# EAGLE design untitled (EAGLE 9.6.2)
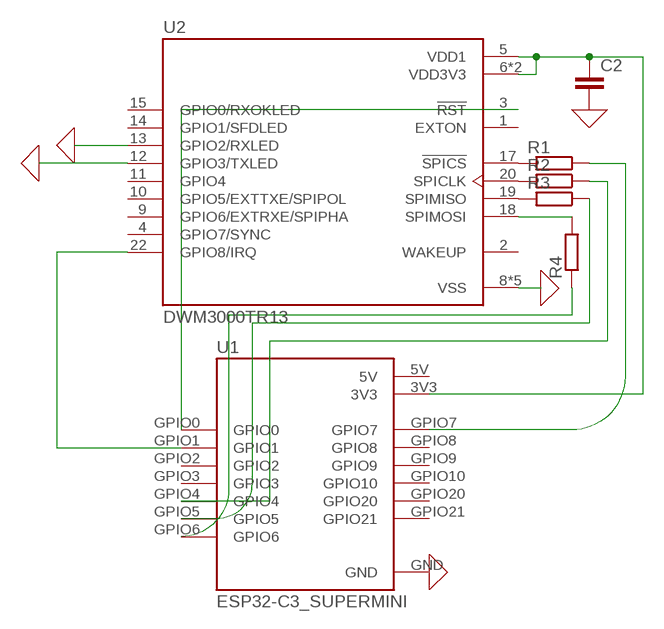
[diagram p0: schematic, sheet 1]

## Parts
C2  C-EUC0402K  [C0402K]
R1  SMK  [SMK]
R2  SMK  [SMK]
R3  SMK  [SMK]
R4  SMK  [SMK]
U1  ESP32-C3_SUPERMINI  [MODULE_ESP32-C3_SUPERMINI]
U2  DWM3000TR13  [XCVR_DWM3000TR13]

## Nets
0: C2.2 U1.GND U2.8(VSS) U2.12(GPIO3/TXLED) U2.13(GPIO2/RXLED) U2.16(VSS) U2.21(VSS) U2.23(VSS) U2.24(VSS) ; supply symbol labelled GND
N$1: U1.GPIO1 U2.22(GPIO8/IRQ)
N$2: C2.1 U1.3V3 U2.5(VDD1) U2.6(VDD3V3) U2.7(VDD3V3)
N$3: U1.GPIO0 U2.3(!RST)
N$4: R1.2 U2.17(!SPICS)
N$5: R1.1 U1.GPIO7
N$6: R2.2 U2.20(SPICLK)
N$7: R2.1 U1.GPIO4
N$8: R3.2 U2.19(SPIMISO)
N$9: R3.1 U1.GPIO5
N$10: R4.1 U2.18(SPIMOSI)
N$11: R4.2 U1.GPIO6
Unconnected: U1.GPIO2 U1.GPIO3 U1.GPIO8 U1.GPIO9 U1.GPIO10 U1.GPIO20 U1.GPIO21 U2.1(EXTON) U2.2(WAKEUP) U2.4(GPIO7/SYNC) U2.9(GPIO6/EXTRXE/SPIPHA) U2.10(GPIO5/EXTTXE/SPIPOL) U2.11(GPIO4) U2.14(GPIO1/SFDLED) U2.15(GPIO0/RXOKLED)

## Power pins joined to a net without a drawn wire
5V: U1.5V

## Library data of the parts
C2 = resistor:C-EU: CAPACITOR, European symbol
R1-R4 = resistor-shunt:SMK: SMD SHUNT RESISTOR; OC_FARNELL: unknown; OC_NEWARK: unknown
U1 = ESP32-C3_SUPERMINI:ESP32-C3_SUPERMINI: Check availability <https://pricing.snapeda.com/parts/ESP32-C3%20SuperMini/Espressif%20Systems/view-part?ref=eda>; AVAILABILITY: Not in stock; CHECK_PRICES: https://www.snapeda.com/parts/ESP32-C3%20SuperMini/Espressif+Systems/view-part/?ref=eda; DESCRIPTION: Super tiny ESP32-C3 board; MF: Espressif Systems; MP: ESP32-C3 SuperMini; PACKAGE: Package; PRICE: None; SNAPEDA_LINK: https://www.snapeda.com/parts/ESP32-C3%20SuperMini/Espressif+Systems/view-part/?ref=snap
U2 = DWM3000TR13:DWM3000TR13: Check availability <https://pricing.snapeda.com/parts/DWM3000TR13/Qorvo/view-part?ref=eda>; AVAILABILITY: In Stock; CHECK_PRICES: https://www.snapeda.com/parts/DWM3000TR13/Qorvo/view-part/?ref=eda; DESCRIPTION: RF Modules DW1000 based module; MF: Qorvo; MP: DWM3000TR13; PACKAGE: None; PRICE: None; SNAPEDA_LINK: https://www.snapeda.com/parts/DWM3000TR13/Qorvo/view-part/?ref=snap

## Board
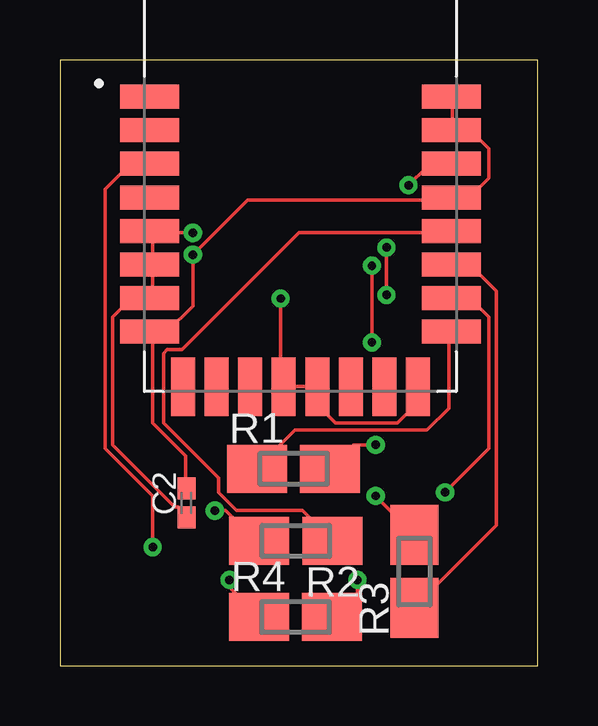
[diagram p1: board, top side]
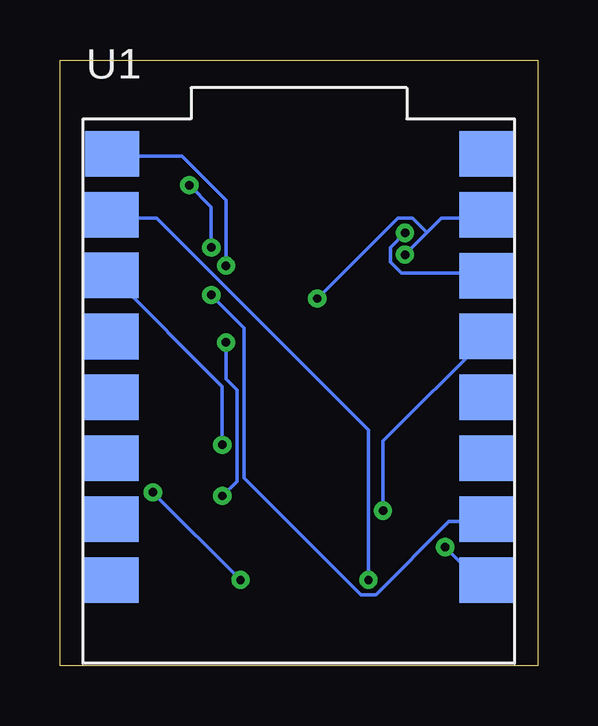
[diagram p2: board, bottom side, seen from below]

Size 19.93 x 25.26 mm. Coordinates in mm from the lower left corner, seen from the top.
Outline: 0,0 19.93,0 19.93,25.26 0,25.26 0,0
Copper layers (1*16): Top 0.035mm / dielectric 1.5mm / Bottom 0.035mm
Design rules "default": minimum track width 6mil, minimum drill 0.35mm, track to track 6mil, track to pad 6mil, pad to pad 6mil, via to via 6mil, smd to smd 6mil, copper to edge 40mil, drill to drill 6mil, minimum pad ring 10mil, minimum via ring 8mil, stop-mask expansion 4mil, vias tented up to drill 0mil, thermal gap 10mil

### Footprints (pad centres in the part's own frame; a part is rotated, then mirrored left to right if it is on the bottom)
C0402K = smd 0.925 x 0.74: 1 -0.6,0; 2 0.6,0
SMK = smd 2.5 x 2: 1 1.524,0; 2 -1.524,0
MODULE_ESP32-C3_SUPERMINI = smd 2.25 x 1.9: 3V3 7.803,4.818; 5V 7.805,9.897; GND 7.803,7.36; GPIO0 7.803,-7.883; GPIO1 7.803,-5.335; GPIO2 7.803,-2.793; GPIO3 7.803,-0.258; GPIO4 7.803,2.283; GPIO5 -7.793,9.901; GPIO6 -7.804,7.356; GPIO7 -7.804,4.823; GPIO8 -7.804,2.278; GPIO9 -7.804,-0.256; GPIO10 -7.804,-2.801; GPIO20 -7.804,-5.334; GPIO21 -7.804,-7.879
XCVR_DWM3000TR13 = smd 2.45 x 1: 1 -6.295,0.95; 2 -6.295,-0.45; 3 -6.295,-1.85; 4 -6.295,-3.25; 5 -6.295,-4.65; 6 -6.295,-6.05; 7 -6.295,-7.45; 8 -6.295,-8.85; 17 6.295,-8.85; 18 6.295,-7.45; 19 6.295,-6.05; 20 6.295,-4.65; 21 6.295,-3.25; 22 6.295,-1.85; 23 6.295,-0.45; 24 6.295,0.95 | smd 1 x 2.45: 9 -4.9,-11.145; 10 -3.5,-11.145; 11 -2.1,-11.145; 12 -0.7,-11.145; 13 0.7,-11.145; 14 2.1,-11.145; 15 3.5,-11.145; 16 4.9,-11.145

### Placement (x,y rotation side)
C2  5.28,6.79 90 top
R1  9.74,8.22 0 top
R2  9.83,5.21 180 top
R3  14.78,3.93 90 top
R4  9.82,2.04 0 top
U1  9.96,11.45 0 bottom
U2  10.03,22.78 0 top

### Tracks (layer width: path | path; a pad name or v marks a point on that pad's centre or on a via)
0  (via drill 0.35)
  Top 0.152: U2.16 14.84,11.5 14.84,10.89 14.08,10.13 11.49,10.13 10.88,10.74 10.88,11.5 U2.13 10.73,11.65 9.35,11.65 U2.12 9.2,11.65 v9.2,15.31 | U2.24 16.36,23.69 16.36,22.47 U2.23 16.36,22.32 17.13,22.32 17.89,21.56 17.89,20.34 17.13,19.58 16.36,19.58 U2.21 16.21,19.43 7.83,19.43 v5.54,17.14 5.54,15.01 4.48,13.94 3.87,13.94 U2.8 3.87,13.79 3.87,10.13 5.24,8.76 5.24,7.54 C2.2
  Bottom 0.152: v5.54,17.14 4.63,18.05 | 4.63,18.05 4.02,18.66 2.19,18.66 U1.GND | v9.2,15.31 5.85,18.66 5.24,18.66 4.63,18.05
N$1  (via drill 0.35)
  Top 0.152: v13.62,17.44 v13.62,15.46 | v14.54,20.03 15.3,20.8 16.21,20.8 U2.22
  Bottom 0.152: v13.62,15.46 12.25,14.09 12.25,7.84 7.37,2.97 6.76,2.97 3.72,6.01 2.19,6.01 U1.GPIO1 | v13.62,17.44 13.62,19.12 v14.54,20.03
N$2  (via drill 0.35)
  Top 0.152: 3.87,18.05 v5.54,18.05 | 3.87,18.05 3.87,16.84 U2.6 3.87,16.68 3.87,15.46 U2.7 3.72,15.31 2.95,15.31 2.19,14.55 2.19,9.22 4.78,6.62 4.93,6.62 5.24,6.32 C2.1 | 3.87,18.05 U2.5
  Bottom 0.152: v5.54,18.05 6.15,17.44 6.15,16.84 5.7,16.38 2.19,16.38 U1.3V3
N$3  (via drill 0.35)
  Top 0.152: v3.87,4.95 3.87,7.08 1.89,9.06 1.89,19.88 2.8,20.8 3.72,20.8 U2.3
  Bottom 0.152: v3.87,4.95 2.5,3.58 2.19,3.58 U1.GPIO0
N$4
  Top 0.152: U2.17 16.21,13.79 16.21,10.74 15.3,9.82 9.81,9.82 8.29,8.3 R1.2
N$5  (via drill 0.35)
  Top 0.152: v13.16,9.22 12.25,9.22 11.34,8.3 R1.1
  Bottom 0.152: v13.16,9.22 13.16,11.65 17.74,16.23 U1.GPIO7
N$6
  Top 0.152: U2.20 16.21,18.05 9.96,18.05 5.09,13.18 4.48,13.18 4.32,13.02 4.32,10.13 6.61,7.84 6.61,7.23 7.37,6.47 10.12,6.47 11.34,5.25 R2.2
N$7  (via drill 0.35)
  Top 0.152: v6.46,6.47 6.92,6.47 8.29,5.1 R2.1
  Bottom 0.152: v6.46,6.47 6.46,9.37 2.19,13.63 U1.GPIO4
N$8
  Top 0.152: U2.19 16.36,16.68 17.13,16.68 18.19,15.62 18.19,5.86 14.84,2.51 R3.2
N$9  (via drill 0.35)
  Top 0.152: v13.01,13.48 v13.01,16.68 | v13.16,7.08 14.69,5.56 R3.1
  Bottom 0.152: v13.01,16.68 13.01,19.43 14.84,21.25 17.74,21.25 U1.GPIO5 | v13.01,13.48 13.01,11.96 12.55,11.5 12.55,7.69 v13.16,7.08
N$10  (via drill 0.35)
  Top 0.152: v16.06,7.23 17.89,9.06 17.89,14.55 17.13,15.31 16.36,15.31 U2.18 | v12.4,3.58 12.4,2.97 11.49,2.05 R4.1
  Bottom 0.152: v12.4,3.58 v16.06,7.23
N$11  (via drill 0.35)
  Top 0.152: v7.07,3.58 7.07,3.27 8.29,2.05 R4.2
  Bottom 0.152: v7.07,3.58 7.07,9.82 15.91,18.66 17.74,18.66 U1.GPIO6